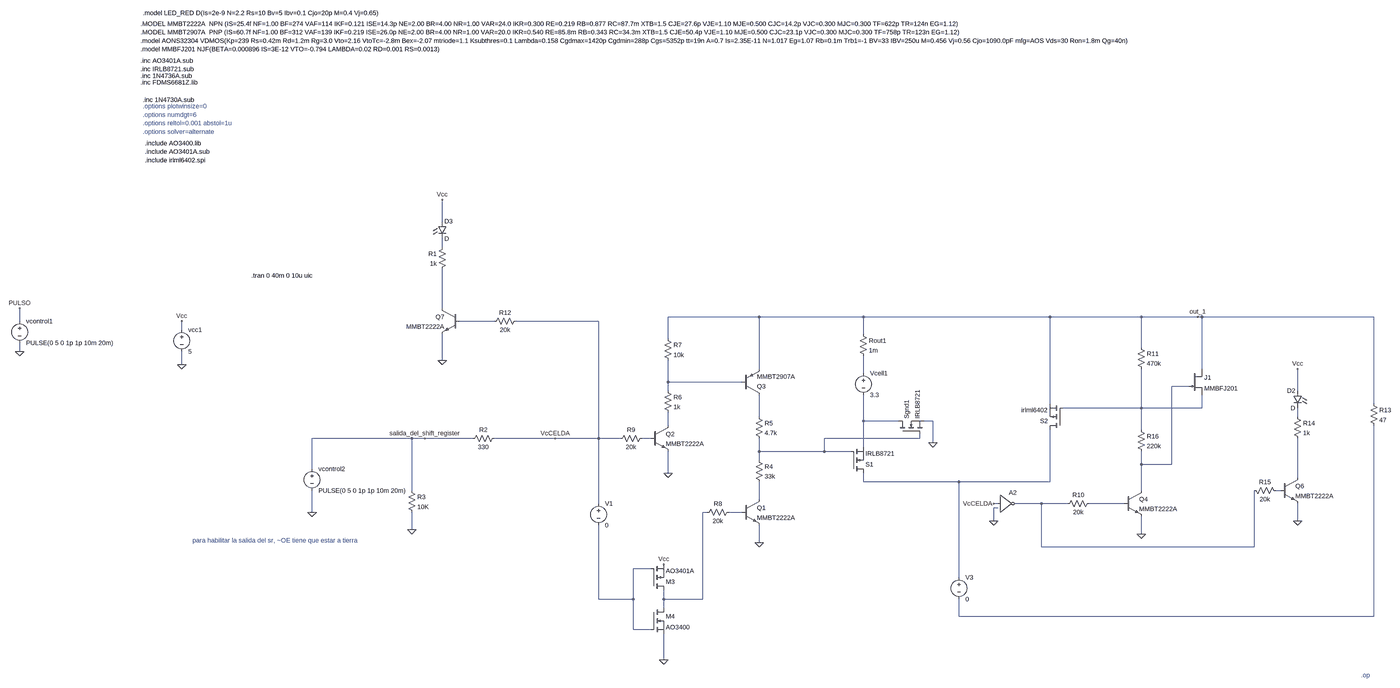
[diagram p0: schematic Prueba plaquita PMOS.asc, whole sheet]
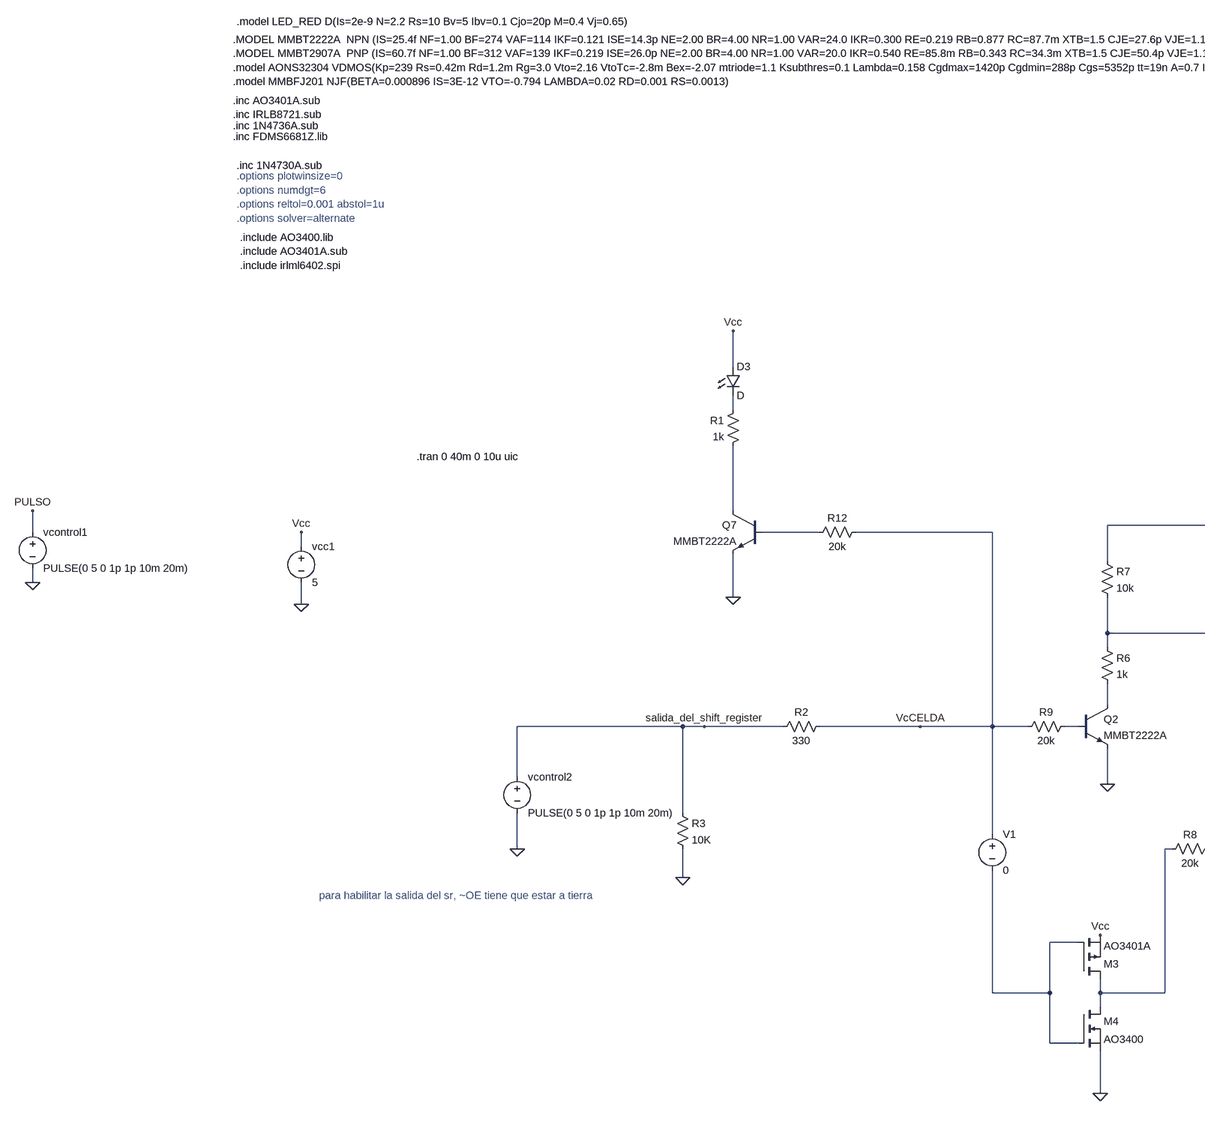
[diagram p1: schematic Prueba plaquita PMOS.asc, part, row 1 of 1, column 1 of 2]
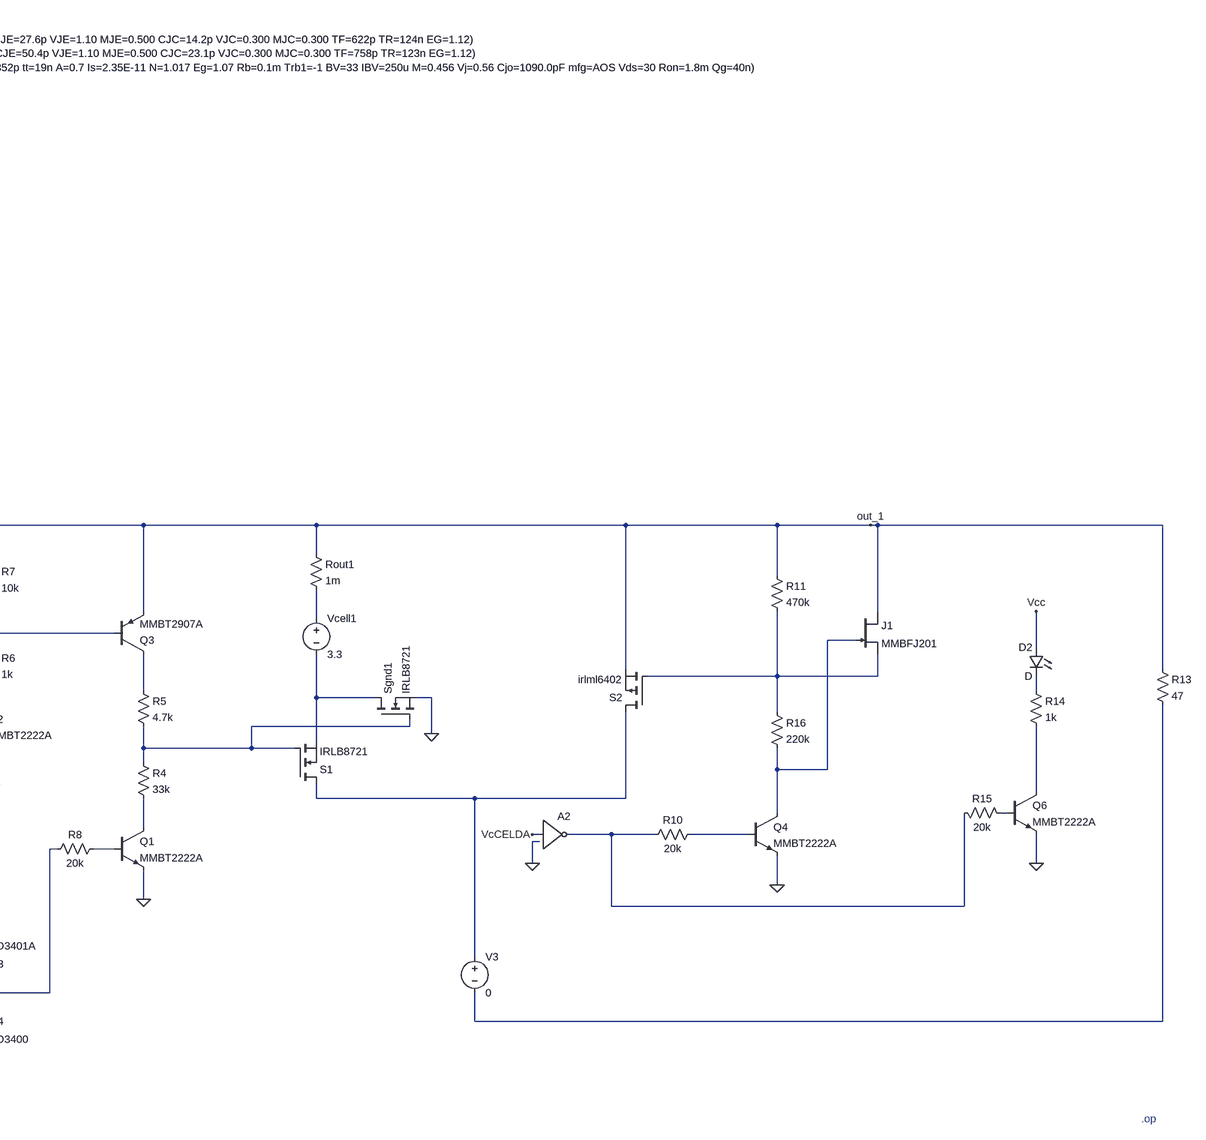
[diagram p2: schematic Prueba plaquita PMOS.asc, part, row 1 of 1, column 2 of 2]
Prueba plaquita PMOS.asc, the LTspice schematic file:
Version 4.1
SHEET 1 5252 680
WIRE 1520 -1168 1520 -1248
WIRE 1520 -1072 1520 -1104
WIRE 1520 -848 1520 -992
WIRE 2688 -816 2352 -816
WIRE 3072 -816 2688 -816
WIRE 3760 -816 3072 -816
WIRE 4096 -816 3760 -816
WIRE 4304 -816 4096 -816
WIRE 4320 -816 4304 -816
WIRE 5040 -816 4320 -816
WIRE -224 -800 -224 -848
WIRE 1712 -800 1584 -800
WIRE 2096 -800 1792 -800
WIRE 560 -768 560 -800
WIRE 3072 -752 3072 -816
WIRE 2352 -736 2352 -816
WIRE 4096 -704 4096 -816
WIRE -224 -688 -224 -720
WIRE 1520 -656 1520 -752
WIRE 560 -640 560 -688
WIRE 2688 -624 2688 -816
WIRE 4320 -624 4320 -816
WIRE 3072 -608 3072 -672
WIRE 2352 -576 2352 -656
WIRE 2624 -576 2352 -576
WIRE 4272 -560 4208 -560
WIRE 2352 -544 2352 -576
WIRE 4672 -544 4672 -624
WIRE 3760 -496 3760 -816
WIRE 5040 -496 5040 -816
WIRE 4096 -480 4096 -624
WIRE 4096 -480 3808 -480
WIRE 4320 -480 4320 -528
WIRE 4320 -480 4096 -480
WIRE 2688 -448 2688 -528
WIRE 4672 -448 4672 -480
WIRE 3072 -432 3072 -528
WIRE 3200 -432 3072 -432
WIRE 3328 -432 3296 -432
WIRE 2352 -416 2352 -464
WIRE 4096 -400 4096 -480
WIRE 1408 -368 1040 -368
WIRE 1456 -368 1408 -368
WIRE 1632 -368 1456 -368
WIRE 1936 -368 1712 -368
WIRE 2096 -368 2096 -800
WIRE 2096 -368 1936 -368
WIRE 2176 -368 2096 -368
WIRE 2288 -368 2256 -368
WIRE 3280 -368 3280 -384
WIRE 3280 -368 2928 -368
WIRE 3328 -352 3328 -432
WIRE 3072 -336 3072 -432
WIRE 2688 -320 2688 -368
WIRE 2928 -320 2928 -368
WIRE 2928 -320 2688 -320
WIRE 3024 -320 2928 -320
WIRE 2688 -288 2688 -320
WIRE 4096 -272 4096 -320
WIRE 4208 -272 4208 -560
WIRE 4208 -272 4096 -272
WIRE 1040 -256 1040 -368
WIRE 2352 -240 2352 -320
WIRE 4672 -224 4672 -368
WIRE 3072 -208 3072 -240
WIRE 3424 -208 3072 -208
WIRE 3760 -208 3760 -400
WIRE 3760 -208 3424 -208
WIRE 1408 -176 1408 -368
WIRE 4096 -176 4096 -272
WIRE 4608 -176 4592 -176
WIRE 2688 -144 2688 -208
WIRE 2096 -128 2096 -368
WIRE 3568 -128 3552 -128
WIRE 3728 -128 3632 -128
WIRE 3824 -128 3728 -128
WIRE 4032 -128 3904 -128
WIRE 3568 -112 3552 -112
WIRE 1040 -96 1040 -176
WIRE 2496 -96 2480 -96
WIRE 2624 -96 2576 -96
WIRE 3552 -64 3552 -112
WIRE 4672 -64 4672 -128
WIRE 1408 -32 1408 -96
WIRE 4096 -16 4096 -80
WIRE 2688 16 2688 -48
WIRE 3728 32 3728 -128
WIRE 4512 32 4512 -176
WIRE 4512 32 3728 32
WIRE 2288 112 2224 112
WIRE 3424 144 3424 -208
WIRE 2096 224 2096 -48
WIRE 2224 224 2224 112
WIRE 2224 224 2096 224
WIRE 2336 224 2336 192
WIRE 2480 224 2480 -96
WIRE 2480 224 2336 224
WIRE 2336 256 2336 224
WIRE 3424 288 3424 224
WIRE 5040 288 5040 -416
WIRE 5040 288 3424 288
WIRE 2224 336 2224 224
WIRE 2288 336 2224 336
WIRE 2336 448 2336 352
FLAG 1040 -96 0
FLAG -224 -688 0
FLAG 560 -640 0
FLAG 560 -800 Vcc
FLAG -224 -848 PULSO
FLAG 1408 -32 0
FLAG 2352 -240 0
FLAG 2688 16 0
FLAG 1936 -368 VcCELDA
FLAG 4304 -816 out_1
FLAG 4096 -16 0
FLAG 3328 -352 0
FLAG 4672 -624 Vcc
FLAG 3552 -64 0
FLAG 3552 -128 VcCELDA
FLAG 1520 -1248 Vcc
FLAG 2336 448 0
FLAG 2336 96 Vcc
FLAG 1456 -368 salida_del_shift_register
FLAG 1520 -656 0
FLAG 4672 -64 0
DATAFLAG 2272 112 "$-V(N001)"
DATAFLAG 3552 -816 ""
DATAFLAG 3520 -208 ""
DATAFLAG 3072 -448 ""
SYMBOL voltage -224 -816 R0
WINDOW 123 0 0 Left 0
WINDOW 39 0 0 Left 0
SYMATTR InstName vcontrol1
SYMATTR Value PULSE(0 5 0 1p 1p 10m 20m)
SYMBOL voltage 560 -784 R0
WINDOW 123 0 0 Left 0
WINDOW 39 0 0 Left 0
SYMATTR InstName vcc1
SYMATTR Value 5
SYMBOL res 1392 -192 R0
SYMATTR InstName R3
SYMATTR Value 10K
SYMBOL npn 2624 -144 R0
SYMATTR InstName Q1
SYMATTR Value MMBT2222A
SYMBOL res 2672 -304 R0
SYMATTR InstName R4
SYMATTR Value 33k
SYMBOL res 2672 -464 R0
SYMATTR InstName R5
SYMATTR Value 4.7k
SYMBOL npn 2288 -416 R0
SYMATTR InstName Q2
SYMATTR Value MMBT2222A
SYMBOL res 2336 -560 R0
SYMATTR InstName R6
SYMATTR Value 1k
SYMBOL res 2336 -752 R0
SYMATTR InstName R7
SYMATTR Value 10k
SYMBOL res 2592 -112 R90
WINDOW 0 0 56 VBottom 2
WINDOW 3 32 56 VTop 2
SYMATTR InstName R8
SYMATTR Value 20k
SYMBOL voltage 3072 -624 R0
WINDOW 123 0 0 Left 0
WINDOW 39 0 0 Left 0
SYMATTR InstName Vcell1
SYMATTR Value 3.3
SYMBOL pnp 2624 -528 M180
SYMATTR InstName Q3
SYMATTR Value MMBT2907A
SYMBOL nmos 3024 -240 M180
SYMATTR InstName S1
SYMATTR Value IRLB8721
SYMATTR Prefix X
SYMBOL res 2272 -384 R90
WINDOW 0 0 56 VBottom 2
WINDOW 3 32 56 VTop 2
SYMATTR InstName R9
SYMATTR Value 20k
SYMBOL res 3056 -768 R0
SYMATTR InstName Rout1
SYMATTR Value 1m
SYMBOL npn 4032 -176 R0
SYMATTR InstName Q4
SYMATTR Value MMBT2222A
SYMBOL res 3920 -144 R90
WINDOW 0 0 56 VBottom 2
WINDOW 3 32 56 VTop 2
SYMATTR InstName R10
SYMATTR Value 20k
SYMBOL res 4080 -720 R0
SYMATTR InstName R11
SYMATTR Value 470k
SYMBOL nmos 3200 -384 R270
SYMATTR InstName Sgnd1
SYMATTR Value IRLB8721
SYMATTR Prefix X
SYMBOL pmos 3808 -400 R180
SYMATTR InstName S2
SYMATTR Value irlml6402
SYMATTR Prefix X
SYMBOL npn 4608 -224 R0
SYMATTR InstName Q6
SYMATTR Value MMBT2222A
SYMBOL res 4656 -464 R0
SYMATTR InstName R14
SYMATTR Value 1k
SYMBOL res 4496 -192 M90
WINDOW 0 0 56 VBottom 2
WINDOW 3 32 56 VTop 2
SYMATTR InstName R15
SYMATTR Value 20k
SYMBOL LED 4688 -544 M0
SYMATTR InstName D2
SYMBOL res 4080 -416 R0
SYMATTR InstName R16
SYMATTR Value 220k
SYMBOL Digital\\inv 3568 -192 R0
SYMATTR InstName A2
SYMBOL npn 1584 -848 M0
SYMATTR InstName Q7
SYMATTR Value MMBT2222A
SYMBOL res 1536 -1088 M0
SYMATTR InstName R1
SYMATTR Value 1k
SYMBOL LED 1504 -1168 R0
SYMATTR InstName D3
SYMBOL res 1808 -816 R90
WINDOW 0 0 56 VBottom 2
WINDOW 3 32 56 VTop 2
SYMATTR InstName R12
SYMATTR Value 20k
SYMBOL pmos 2288 192 M180
SYMATTR InstName M3
SYMATTR Value AO3401A
SYMATTR Prefix X
SYMBOL nmos 2288 256 R0
SYMATTR InstName M4
SYMATTR Value AO3400
SYMATTR Prefix X
SYMBOL voltage 2096 -144 R0
WINDOW 123 0 0 Left 0
WINDOW 39 0 0 Left 0
SYMATTR InstName V1
SYMATTR Value 0
SYMBOL res 1728 -384 R90
WINDOW 0 0 56 VBottom 2
WINDOW 3 32 56 VTop 2
SYMATTR InstName R2
SYMATTR Value 330
SYMBOL res 5024 -512 R0
SYMATTR InstName R13
SYMATTR Value 47
SYMBOL voltage 3424 128 R0
WINDOW 123 0 0 Left 0
WINDOW 39 0 0 Left 0
SYMATTR InstName V3
SYMATTR Value 0
SYMBOL njf 4272 -624 R0
SYMATTR InstName J1
SYMATTR Value MMBFJ201
SYMBOL voltage 1040 -272 R0
WINDOW 123 0 0 Left 0
WINDOW 39 0 0 Left 0
SYMATTR InstName vcontrol2
SYMATTR Value PULSE(0 5 0 1p 1p 10m 20m)
TEXT 424 -1456 Left 2 !.include AO3400.lib\n.include AO3401A.sub\n.include irlml6402.spi
TEXT 600 8 Left 2 ;para habilitar la salida del sr, ~OE tiene que estar a tierra
TEXT 816 -968 Left 2 !.tran 0 40m 0 10u uic
TEXT 408 -1896 Left 2 !.MODEL MMBT2222A  NPN (IS=25.4f NF=1.00 BF=274 VAF=114 IKF=0.121 ISE=14.3p NE=2.00 BR=4.00 NR=1.00 VAR=24.0 IKR=0.300 RE=0.219 RB=0.877 RC=87.7m XTB=1.5 CJE=27.6p VJE=1.10 MJE=0.500 CJC=14.2p VJC=0.300 MJC=0.300 TF=622p TR=124n EG=1.12)\n.MODEL MMBT2907A  PNP (IS=60.7f NF=1.00 BF=312 VAF=139 IKF=0.219 ISE=26.0p NE=2.00 BR=4.00 NR=1.00 VAR=20.0 IKR=0.540 RE=85.8m RB=0.343 RC=34.3m XTB=1.5 CJE=50.4p VJE=1.10 MJE=0.500 CJC=23.1p VJC=0.300 MJC=0.300 TF=758p TR=123n EG=1.12)\n.model AONS32304 VDMOS(Kp=239 Rs=0.42m Rd=1.2m Rg=3.0 Vto=2.16 VtoTc=-2.8m Bex=-2.07 mtriode=1.1 Ksubthres=0.1 Lambda=0.158 Cgdmax=1420p Cgdmin=288p Cgs=5352p tt=19n A=0.7 Is=2.35E-11 N=1.017 Eg=1.07 Rb=0.1m Trb1=-1 BV=33 IBV=250u M=0.456 Vj=0.56 Cjo=1090.0pF mfg=AOS Vds=30 Ron=1.8m Qg=40n)\n.model MMBFJ201 NJF(BETA=0.000896 IS=3E-12 VTO=-0.794 LAMBDA=0.02 RD=0.001 RS=0.0013)
TEXT 408 -1760 Left 2 !.inc AO3401A.sub\n.inc IRLB8721.sub
TEXT 408 -1704 Left 2 !.inc 1N4736A.sub
TEXT 416 -1592 Left 2 ;.options plotwinsize=0\n.options numdgt=6\n.options reltol=0.001 abstol=1u\n.options solver=alternate
TEXT 408 -1680 Left 2 !.inc FDMS6681Z.lib
TEXT 416 -1616 Left 2 !.inc 1N4730A.sub
TEXT 416 -1936 Left 2 !.model LED_RED D(Is=2e-9 N=2.2 Rs=10 Bv=5 Ibv=0.1 Cjo=20p M=0.4 Vj=0.65)
TEXT 4992 504 Left 2 ;.op

The netlist it stands for:
* Prueba plaquita PMOS.asc
vcontrol1 PULSO 0 PULSE(0 5 0 1p 1p 10m 20m)
vcc1 Vcc 0 5
R3 salida_del_shift_register 0 10K
Q1 N017 N021 0 0 MMBT2222A
R4 N013 N017 33k
R5 N008 N013 4.7k
Q2 N011 N012 0 0 MMBT2222A
R6 N005 N011 1k
R7 out_1 N005 10k
R8 N021 N020 20k
Vcell1 N004 N010 3.3
Q3 N008 N005 out_1 0 MMBT2907A
X§S1 N015 N013 N010 IRLB8721  ; pins D G S
R9 N012 VcCELDA 20k
Rout1 out_1 N004 1m
Q4 N006 N019 0 0 MMBT2222A
R10 N019 N018 20k
R11 out_1 N007 470k
X§Sgnd1 N010 N013 0 IRLB8721  ; pins D G S
X§S2 N015 N007 out_1 irlml6402  ; pins D G S
Q6 N014 N016 0 0 MMBT2222A
R14 N009 N014 1k
R15 N018 N016 20k
D2 Vcc N009 D
R16 N007 N006 220k
A2 VcCELDA 0 0 0 0 N018 0 0 BUF
Q7 N002 N003 0 0 MMBT2222A
R1 N001 N002 1k
D3 Vcc N001 D
R12 VcCELDA N003 20k
X§M3 N020 N022 Vcc AO3401A  ; pins D G S
X§M4 N020 N022 0 AO3400  ; pins D G S
V1 VcCELDA N022 0
R2 VcCELDA salida_del_shift_register 330
R13 out_1 N023 47
V3 N015 N023 0
J1 out_1 N006 N007 MMBFJ201
vcontrol2 salida_del_shift_register 0 PULSE(0 5 0 1p 1p 10m 20m)
.model D D
.lib standard.dio
.model NPN NPN
.model PNP PNP
.lib standard.bjt
.model NJF NJF
.model PJF PJF
.lib standard.jft
.include AO3400.lib
.include AO3401A.sub
.include irlml6402.spi
* para habilitar la salida del sr, ~OE tiene que estar a tierra
.tran 0 40m 0 10u uic
.MODEL MMBT2222A  NPN (IS=25.4f NF=1.00 BF=274 VAF=114 IKF=0.121 ISE=14.3p NE=2.00 BR=4.00 NR=1.00 VAR=24.0 IKR=0.300 RE=0.219 RB=0.877 RC=87.7m XTB=1.5 CJE=27.6p VJE=1.10 MJE=0.500 CJC=14.2p VJC=0.300 MJC=0.300 TF=622p TR=124n EG=1.12)
.MODEL MMBT2907A  PNP (IS=60.7f NF=1.00 BF=312 VAF=139 IKF=0.219 ISE=26.0p NE=2.00 BR=4.00 NR=1.00 VAR=20.0 IKR=0.540 RE=85.8m RB=0.343 RC=34.3m XTB=1.5 CJE=50.4p VJE=1.10 MJE=0.500 CJC=23.1p VJC=0.300 MJC=0.300 TF=758p TR=123n EG=1.12)
.model AONS32304 VDMOS(Kp=239 Rs=0.42m Rd=1.2m Rg=3.0 Vto=2.16 VtoTc=-2.8m Bex=-2.07 mtriode=1.1 Ksubthres=0.1 Lambda=0.158 Cgdmax=1420p Cgdmin=288p Cgs=5352p tt=19n A=0.7 Is=2.35E-11 N=1.017 Eg=1.07 Rb=0.1m Trb1=-1 BV=33 IBV=250u M=0.456 Vj=0.56 Cjo=1090.0pF mfg=AOS Vds=30 Ron=1.8m Qg=40n)
.model MMBFJ201 NJF(BETA=0.000896 IS=3E-12 VTO=-0.794 LAMBDA=0.02 RD=0.001 RS=0.0013)
.inc AO3401A.sub
.inc IRLB8721.sub
.inc 1N4736A.sub
* .options plotwinsize=0
* .options numdgt=6
* .options reltol=0.001 abstol=1u
* .options solver=alternate
.inc FDMS6681Z.lib
.inc 1N4730A.sub
.model LED_RED D(Is=2e-9 N=2.2 Rs=10 Bv=5 Ibv=0.1 Cjo=20p M=0.4 Vj=0.65)
* .op
.backanno
.end